# EAGLE design elflet (EAGLE 9.2.0)
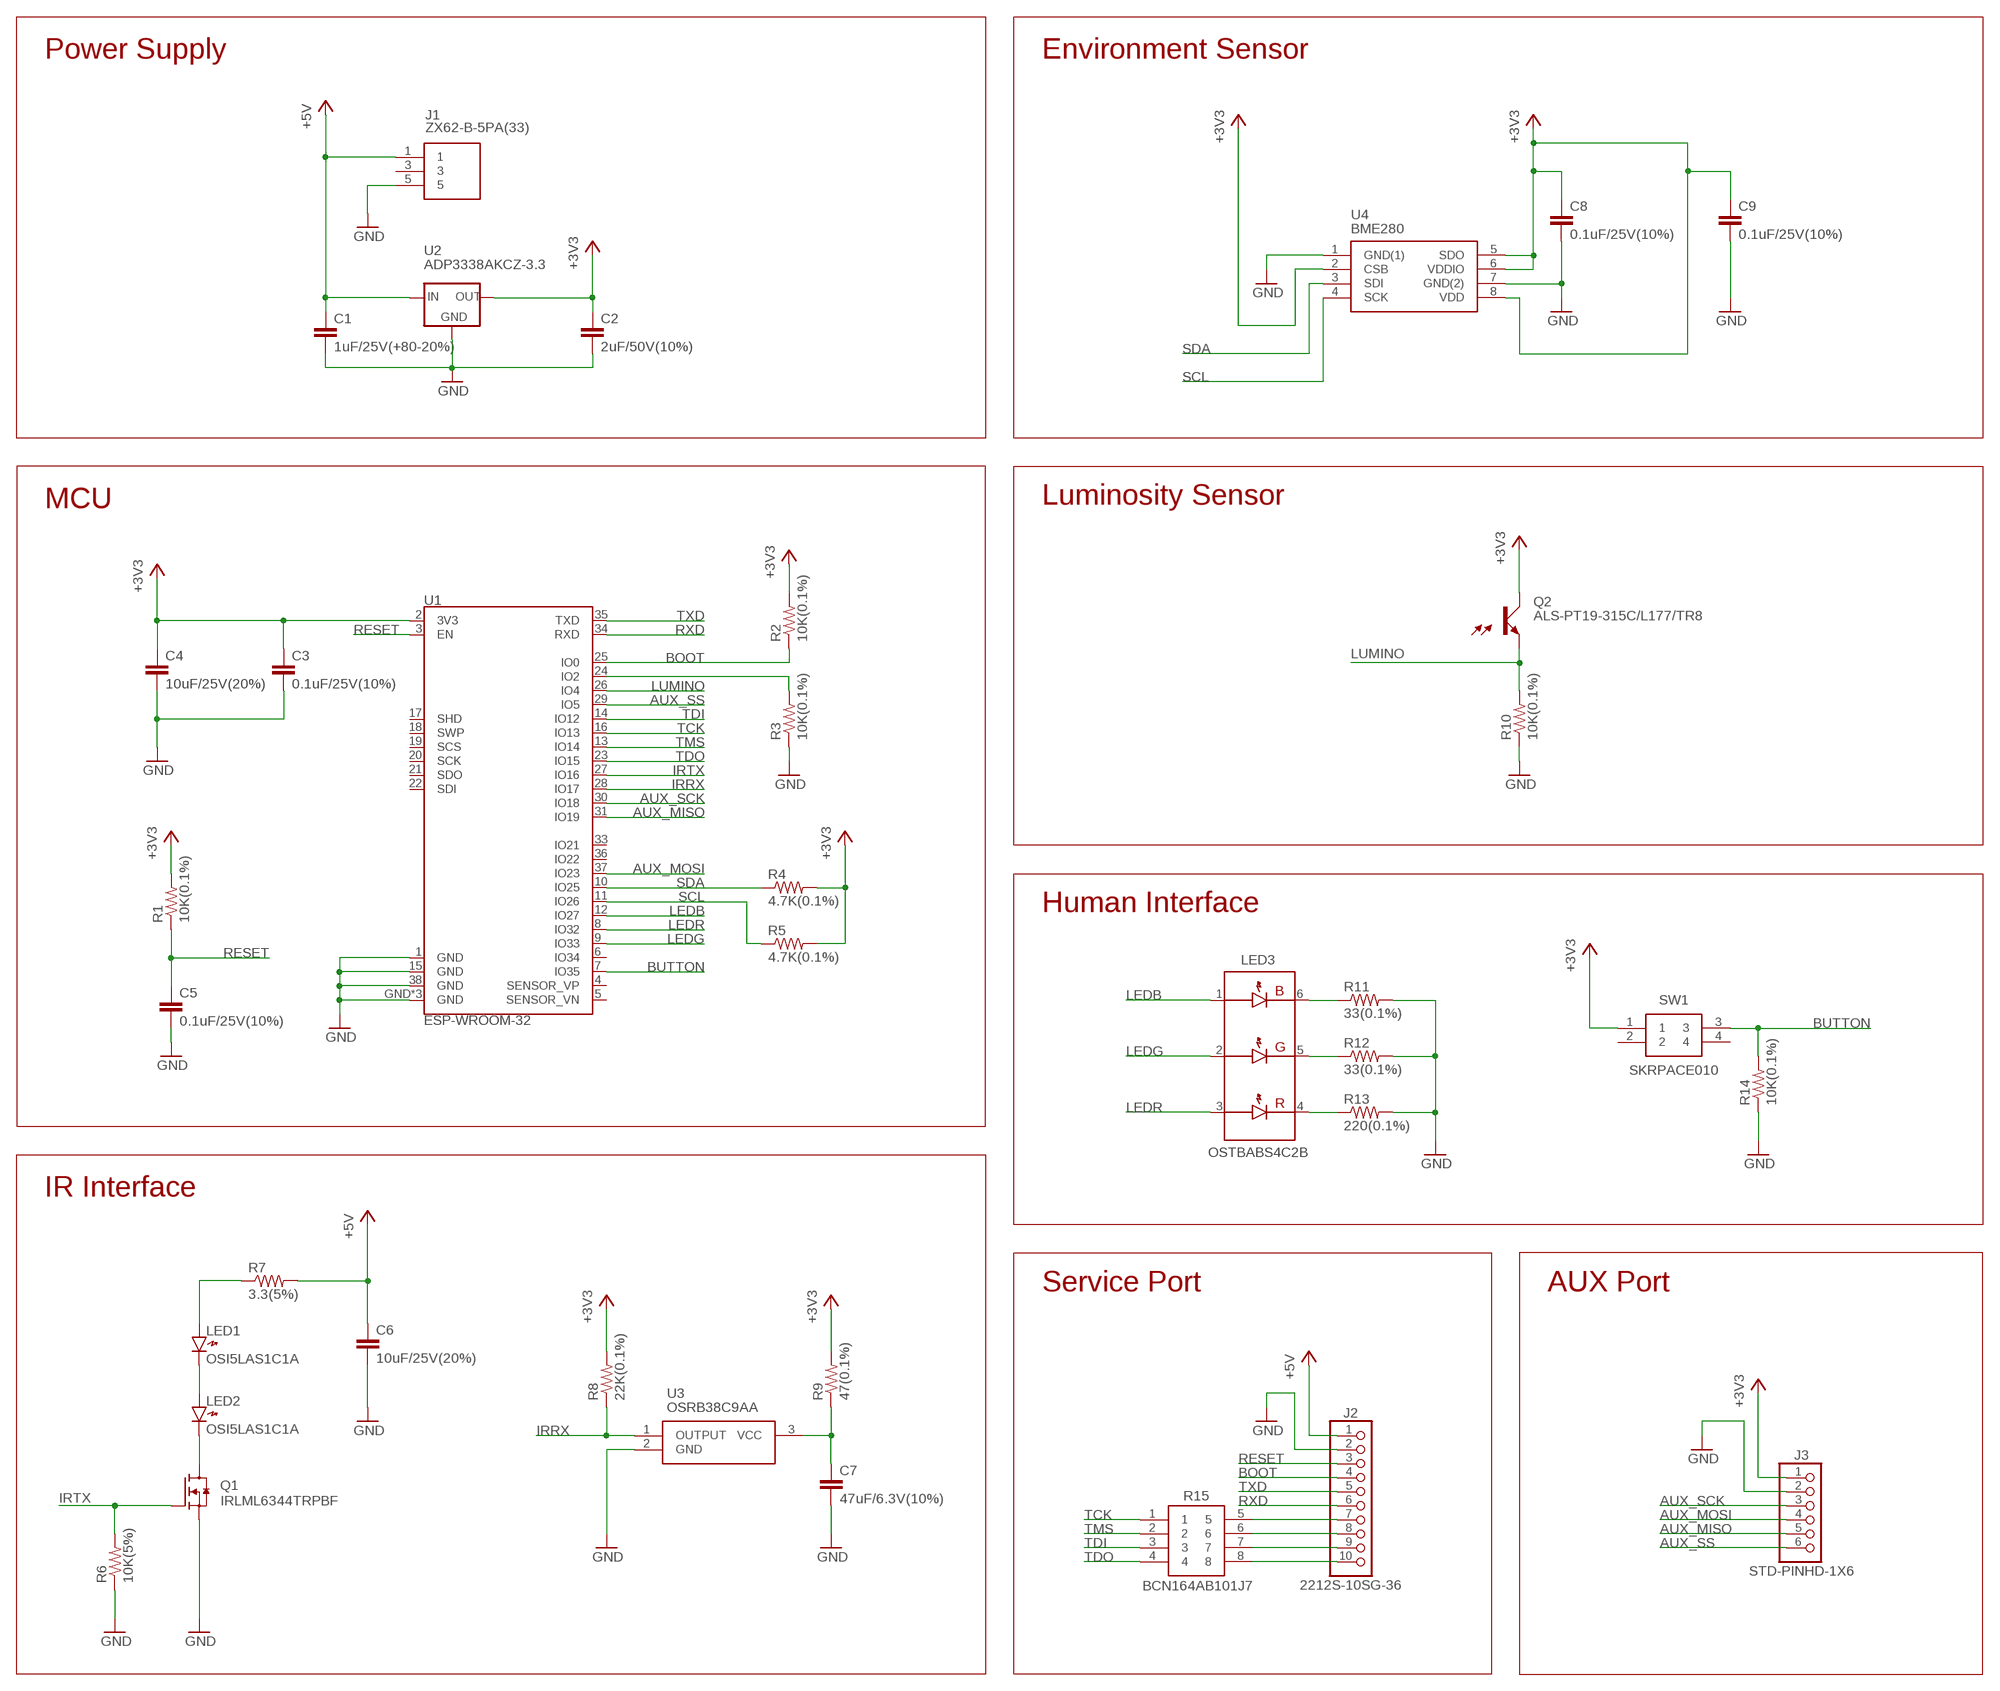
[diagram p0: schematic, sheet 1]

## Parts
C1  1uF/25V(+80-20%)  C-EUC3216  [C3216]
C2  2uF/50V(10%)  C-EUC3216  [C3216]
C3  0.1uF/25V(10%)  C-EUC1608  [C1608]
C4  10uF/25V(20%)  C-EUC1608  [C1608]
C5  0.1uF/25V(10%)  C-EUC1608  [C1608]
C6  10uF/25V(20%)  C-EUC1608  [C1608]
C7  47uF/6.3V(10%)  C-EUC3216  [C3216]
C8  0.1uF/25V(10%)  C-EUC1608  [C1608]
C9  0.1uF/25V(10%)  C-EUC1608  [C1608]
J1  ZX62-B-5PA(33)  [ZX62-B-5PA(33)-TRUE-HANDSOLD]
J2  2212S-10SG-36  STD-PINHD-1X10  [STD-1X10]
J3  STD-PINHD-1X6  [STD-1X6]
LED1  OSI5LAS1C1A  LEDPLCC-2  [PLCC-2]
LED2  OSI5LAS1C1A  LEDPLCC-2  [PLCC-2]
LED3  OSTBABS4C2B  [OSTBABS4C2B]
Q1  IRLML6344TRPBF  [SOT23]
Q2  ALS-PT19-315C/L177/TR8  ALS-PT19-315C_L177_TR8  [ALSPT19315CL177TR8]
R1  10K(0.1%)  R-US_R0805  [R0805]
R2  10K(0.1%)  R-US_R0805  [R0805]
R3  10K(0.1%)  R-US_R0805  [R0805]
R4  4.7K(0.1%)  R-US_R0603  [R0603]
R5  4.7K(0.1%)  R-US_R0603  [R0603]
R6  10K(5%)  R-US_R0805  [R0805]
R7  3.3(5%)  R-US_R2512  [R2512]
R8  22K(0.1%)  R-US_R0603  [R0603]
R9  47(0.1%)  R-US_R0603  [R0603]
R10  10K(0.1%)  R-US_R0805  [R0805]
R11  33(0.1%)  R-US_R0805  [R0805]
R12  33(0.1%)  R-US_R0805  [R0805]
R13  220(0.1%)  R-US_R0805  [R0805]
R14  10K(0.1%)  R-US_R0805  [R0805]
R15  BCN164AB101J7  BCN164A102J7  [BCN164A_1]
SW1  SKRPACE010  [SMT(4.2X3.2)]
U1  ESP-WROOM-32  ESP-WROOM-03  [ESP-WROOM-03]
U2  ADP3338AKCZ-3.3  ADP3338  [SOT223]
U3  OSRB38C9AA  OSRB38C9AATILT  [OSRB38C9AA-ALT]
U4  BME280  [BME280]

## Nets
+3V3 [power]: C2.1 C3.1 C4.1 C8.1 C9.1 J3.1 Q2.1(C) R1.2 R2.2 R4.2 R5.2 R8.2 R9.2 SW1.1 U1.2(3V3) U2.2(OUT) U2.4(OUT) U4.2(CSB) U4.5(SDO) U4.6(VDDIO) U4.8(VDD)
+5V [power]: C1.1 C6.1 J1.1 J2.1 R7.2 U2.3(IN)
AUX_MISO: J3.5 U1.31(IO19)
AUX_MOSI: J3.4 U1.37(IO23)
AUX_SCK: J3.3 U1.30(IO18)
AUX_SS: J3.6 U1.29(IO5)
BOOT: J2.4 R2.1 U1.25(IO0)
BUTTON: R14.2 SW1.3 U1.7(IO35)
GND [gnd]: C1.2 C2.2 C3.2 C4.2 C5.2 C6.2 C7.2 C8.2 C9.2 J1.5 J2.2 J3.2 Q1.2(S) R3.1 R6.1 R10.1 R11.2 R12.2 R13.2 R14.1 U1.1(GND) U1.15(GND) U1.38(GND) U1.GND U1.GND_B(GND) U1.GND_V(GND) U2.1(GND) U3.2(GND) U4.1(GND(1)) U4.7(GND(2))
IRRX: R8.1 U1.28(IO17) U3.1(OUTPUT)
IRTX: Q1.1(G) R6.2 U1.27(IO16)
LEDB: LED3.1(AB) U1.12(IO27)
LEDG: LED3.2(AG) U1.9(IO33)
LEDR: LED3.3(AR) U1.8(IO32)
LUMINO: Q2.2(E) R10.2 U1.26(IO4)
N$1: R3.2 U1.24(IO2)
N$2 [irled]: LED1.1(K) LED2.2(A)
N$3 [irled]: LED2.1(K) Q1.3(D)
N$4 [irled]: LED1.2(A) R7.1
N$5: C7.1 R9.1 U3.3(VCC)
N$6: J2.7 R15.5
N$7: J2.8 R15.6
N$8: J2.9 R15.7
N$9: LED3.6(KB) R11.1
N$10: LED3.5(KG) R12.1
N$11: LED3.4(KR) R13.1
N$12: J2.10 R15.8
RESET: C5.1 J2.3 R1.1 U1.3(EN)
RXD: J2.6 U1.34(RXD)
SCL: R5.1 U1.11(IO26) U4.4(SCK)
SDA: R4.1 U1.10(IO25) U4.3(SDI)
TCK: R15.1 U1.16(IO13)
TDI: R15.3 U1.14(IO12)
TDO: R15.4 U1.23(IO15)
TMS: R15.2 U1.13(IO14)
TXD: J2.5 U1.35(TXD)
Unconnected: J1.3 SW1.2 SW1.4 U1.4(SENSOR_VP) U1.5(SENSOR_VN) U1.6(IO34) U1.17(SHD) U1.18(SWP) U1.19(SCS) U1.20(SCK) U1.21(SDO) U1.22(SDI) U1.33(IO21) U1.36(IO22)

## Notes on the sheet
- Power Supply | Environment Sensor
- Luminosity Sensor
- MCU
- Human Interface
- IR Interface
- Service Port | AUX Port

## Library data of the parts
C1-C9 = rcl:C-EU: CAPACITOR, European symbol; SPICEPREFIX: C
J1 = ZX62-B-5PA(33):ZX62-B-5PA(33): USB Connectors MICRO B RECEPT RA SMT BTTM MNT Source: Datasheet <http://www.mouser.com/ds/2/185/ZX_catalog-939768.pdf>
J2 = connector:STD-PINHD-1X10
J3 = connector:STD-PINHD-1X6
LED1 LED2 = gen-discrete:LED: Generic LEDs
LED3 = OSTBABS4C2B:OSTBABS4C2B
Q1 = IRLML6344TRPBF:IRLML6344TRPBF: IRLML6433TRPBF
Q2 = ALS-PT19-315C_L177_TR8:ALS-PT19-315C_L177_TR8: Ambient Light Sensors Ambient Light Sensor Source: Datasheet <http://www.mouser.com/ds/2/143/201407061531031645-365293.pdf>; ARROW_PART_NUMBER: ALS-PT19-315C/L177/TR8; DESCRIPTION: Ambient Light Sensors Ambient Light Sensor; HEIGHT: 0mm; MANUFACTURER_NAME: Everlight; MANUFACTURER_PART_NUMBER: ALS-PT19-315C/L177/TR8
R1-R6 R8-R14 = rcl:R-US_: RESISTOR, American symbol; SPICEPREFIX: R
R7 = gen-discrete:R-US_: RESISTOR, American symbol; SPICEPREFIX: R
R15 = BCN164A102J7:BCN164A102J7: BI TECHNOLOGIES / TT ELECTRONICS - BCN164A102J7 - RESISTOR, RESISTOR ARRAY, 4, 1KOHM, 5%, 1206 Source: Datasheet <http://www.farnell.com/datasheets/2158867.pdf>; ARROW_PART_NUMBER: BCN164A102J7; DESCRIPTION: BI TECHNOLOGIES / TT ELECTRONICS - BCN164A102J7 - RESISTOR, RESISTOR ARRAY, 4, 1KOHM, 5%, 1206; HEIGHT: mm; MANUFACTURER_NAME: BI Technologies; MANUFACTURER_PART_NUMBER: BCN164A102J7
SW1 = SKRPACE010:SKRPACE010: Tactile Switches 4.2x3.2x2.5mm 260gf Source: Datasheet <http://www.alps.com/prod/info/E/HTML/Tact/SurfaceMount/SKRP/SKRPACE010.html>; ARROW_PART_NUMBER: SKRPACE010; DESCRIPTION: Tactile Switches 4.2x3.2x2.5mm 260gf; HEIGHT: mm; MANUFACTURER_NAME: ALPS; MANUFACTURER_PART_NUMBER: SKRPACE010
U1 = esp32:ESP-WROOM-03
U2 = vreg:ADP3338: ADP3338 low drop out regurator 1A
U3 = OSRB38C9AA:OSRB38C9AA: 7.4*6.2*5.25mm Infrared Receiver Module Source: Datasheet <http://akizukidenshi.com/download/OSRB38C9AA.pdf>
U4 = BME280:BME280: Board Mount Humidity Sensors Source: Datasheet <http://ae-bst.resource.bosch.com/media/products/dokumente/bme280/BST-BME280_DS001-11.pdf>

## Net classes
1 gnd: width 0.457 mm, drill 0.203 mm
2 power: width 0.457 mm, drill 0.203 mm
3 irled: width 0.457 mm, drill 0.203 mm

## Board
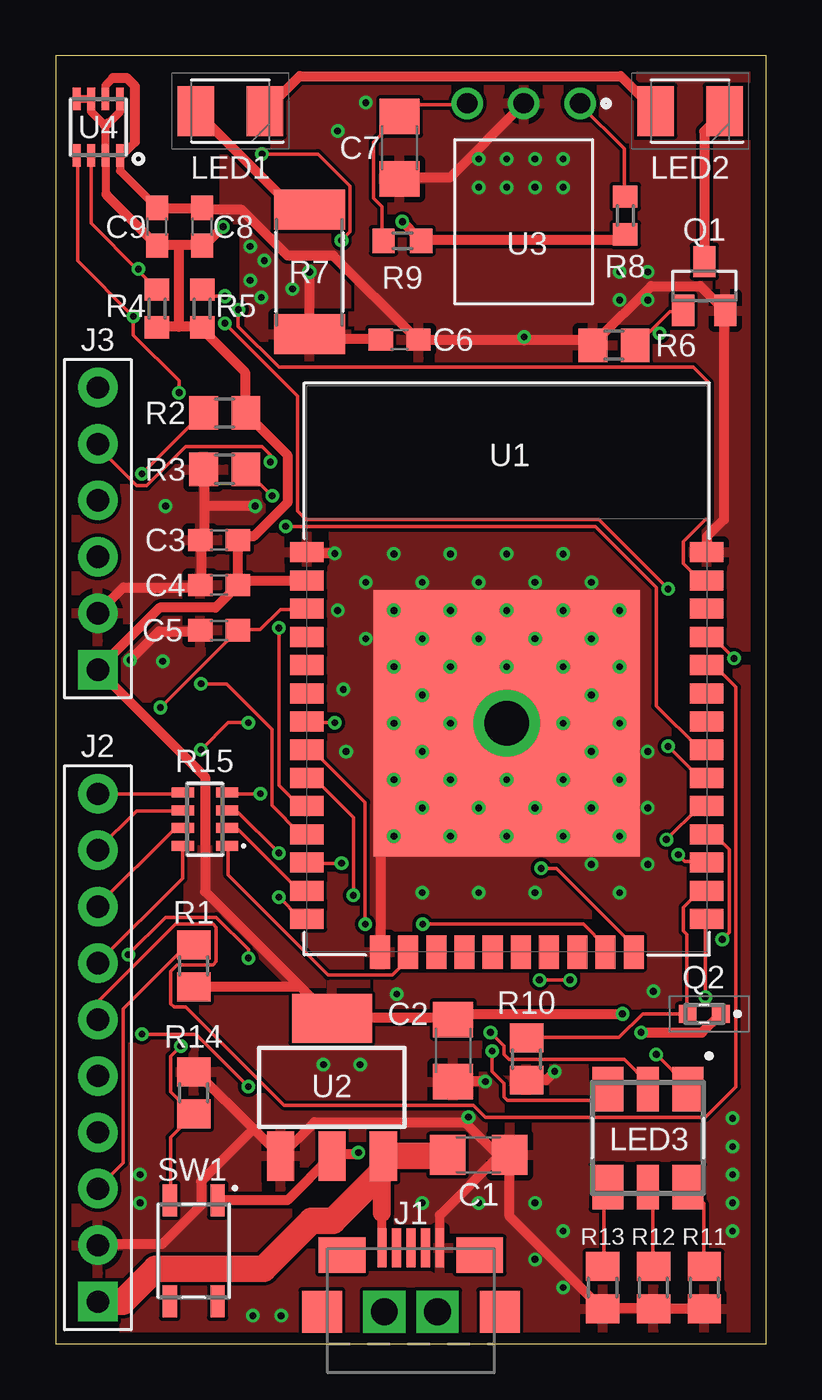
[diagram p1: board, top side]
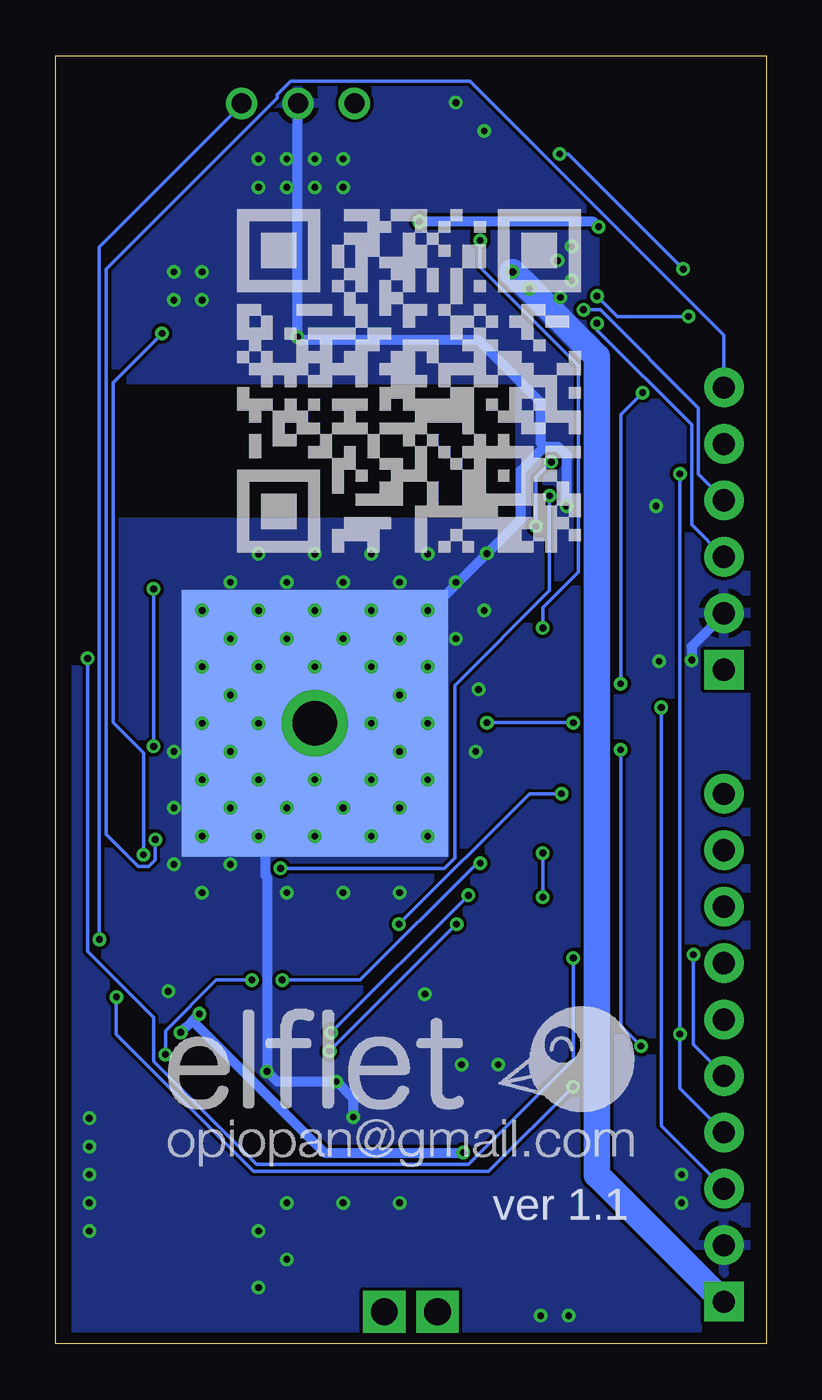
[diagram p2: board, bottom side, seen from below]

Size 32 x 58 mm. Coordinates in mm from the lower left corner, seen from the top.
Outline: 0,0 32,0 32,58 0,58 0,0
Copper layers (1*16): Top 0.035mm / dielectric 1.6mm / Bottom 0.035mm
Design rules "Elecrow_2-layer_PCB_eagle_rule": minimum track width 6mil, minimum drill 12mil, track to track 6mil, track to pad 6mil, pad to pad 6mil, via to via 8mil, smd to smd 0mil, copper to edge 20mil, drill to drill 10mil, minimum pad ring 6mil, minimum via ring 6mil, stop-mask expansion 0mil, vias tented up to drill 100mil, thermal gap 10mil
tRestrict: area 0,0 to 0.7,58; area 31.3,0 to 32,58; area 0,57.3 to 32,58
bRestrict: area 0,57.3 to 32,58; area 0,0 to 0.7,58; area 31.3,0 to 32,58

### Footprints (pad centres in the part's own frame; a part is rotated, then mirrored left to right if it is on the bottom)
C3216 = smd 1.6 x 1.8: 1 -1.4,0; 2 1.4,0
C1608 = smd 1.1 x 1: 1 -0.85,0; 2 0.85,0
ZX62-B-5PA(33)-TRUE-HANDSOLD = smd 0.4 x 1.75: 1 -1.3,2.875; 2 -0.65,2.875; 3 0,2.875; 4 0.65,2.875; 5 1.3,2.875 | smd 2.1 x 1.6: 6 -3.1,2.55; 7 3.1,2.55 | drill 1.2 pad 1.9 square: 8 -1.2,0; 9 1.2,0 | smd 1.8 x 1.9: 10 -4,0; 11 4,0
STD-1X10 = drill 1 pad 1.778 square: 1 -11.43,0 | drill 1 pad 1.778: 2 -8.89,0; 3 -6.35,0; 4 -3.81,0; 5 -1.27,0; 6 1.27,0; 7 3.81,0; 8 6.35,0; 9 8.89,0; 10 11.43,0
STD-1X6 = drill 1 pad 1.778 square: 1 -6.35,0 | drill 1 pad 1.778: 2 -3.81,0; 3 -1.27,0; 4 1.27,0; 5 3.81,0; 6 6.35,0
PLCC-2 = smd 1.65 x 2.25: 1 -1.55,0; 2 1.55,0
OSTBABS4C2B = smd 1.4 x 2: 1 1.8,2.2; 3 -1.8,2.2; 4 -1.8,-2.2; 6 1.8,-2.2 | smd 1 x 2: 2 0,2.2; 5 0,-2.2
SOT23 = smd 1 x 1.4: 1 -0.95,-1.1; 2 0.95,-1.1; 3 0,1.1
ALSPT19315CL177TR8 = smd 0.8 x 0.8: 1 -0.75,0; 2 0.75,0
R0805 = smd 1.3 x 1.5: 1 -0.95,0; 2 0.95,0
R0603 = smd 1 x 1.1: 1 -0.85,0; 2 0.85,0
R2512 = smd 1.8 x 3.2: 1 -2.8,0; 2 2.8,0
BCN164A_1 = smd 0.45 x 1: 1 -1.2,-1; 2 -0.4,-1; 3 0.4,-1; 4 1.2,-1; 5 -1.2,1; 6 -0.4,1; 7 0.4,1; 8 1.2,1
SMT(4.2X3.2) = smd 1.45 x 0.65: 1 -2.275,1.075; 2 2.275,1.075; 3 -2.275,-1.075; 4 2.275,-1.075
ESP-WROOM-03 = smd 0.9 x 1.5: 1 7.7,9; 2 6.43,9; 3 5.16,9; 4 3.89,9; 5 2.62,9; 6 1.35,9; 7 0.08,9; 8 -1.19,9; 9 -2.46,9; 10 -3.73,9; 11 -5,9; 12 -6.27,9; 13 -7.54,9; 14 -8.81,9; 25 -8.81,-9; 26 -7.54,-9; 27 -6.27,-9; 28 -5,-9; 29 -3.73,-9; 30 -2.46,-9; 31 -1.19,-9; 32 0.08,-9; 33 1.35,-9; 34 2.62,-9; 35 3.89,-9; 36 5.16,-9; 37 6.43,-9; 38 7.7,-9 | smd 1.5 x 0.9: 15 -10.3,5.715; 16 -10.3,4.445; 17 -10.3,3.175; 18 -10.3,1.905; 19 -10.3,0.635; 20 -10.3,-0.635; 21 -10.3,-1.905; 22 -10.3,-3.175; 23 -10.3,-4.445; 24 -10.3,-5.715 | smd 12 x 12: GND 0,0 | smd 12 x 12 bottom: GND_B 0,0 | drill 2: GND_V 0,0
SOT223 = smd 1.219 x 2.235: 1 -2.311,-3.099; 2 0,-3.099; 3 2.311,-3.099 | smd 3.6 x 2.2: 4 0,3.099
OSRB38C9AA-ALT = drill 0.91 pad 1.41: 1 -2.54,-1; 2 0,-1; 3 2.54,-1
BME280 = smd 1 x 0.35: 1 2.3,0; 2 2.3,-0.65; 3 2.3,-1.3; 4 2.3,-1.95; 5 -0.25,-1.95; 6 -0.25,-1.3; 7 -0.25,-0.65; 8 -0.25,0

### Placement (x,y rotation side)
C1  19.05,8.51 0 top
C2  17.91,13.21 270 top
C3  7.37,36.2 180 top
C4  7.37,34.16 180 top
C5  7.37,32.13 180 top
C6  15.49,45.21 0 top
C7  15.49,53.85 270 top
C8  6.6,50.29 90 top
C9  4.57,50.29 90 top
J1  16,1.45 0 top
J2  1.91,13.34 90 top
J3  1.91,36.7 90 top
LED1  7.87,55.5 180 top
LED2  28.57,55.5 180 top
LED3  26.67,9.27 0 top
Q1  29.21,47.62 0 top
Q2  29.21,14.86 180 top
R1  6.22,17.02 270 top
R2  7.62,41.91 0 top
R3  7.62,39.37 0 top
R4  4.57,46.61 270 top
R5  6.6,46.61 270 top
R6  25.15,44.96 0 top
R7  11.43,48.26 270 top
R8  25.65,50.8 270 top
R9  15.62,49.66 0 top
R10  21.21,12.83 90 top
R11  29.21,2.54 270 top
R12  26.92,2.54 270 top
R13  24.64,2.54 270 top
R14  6.22,11.3 270 top
R15  6.73,23.62 90 top
SW1  6.22,4.19 270 top
U1  20.32,27.94 90 top
U2  12.45,11.56 0 top
U3  21.08,54.85 180 top
U4  2.9,55.8 270 top
U$1  [ELFLET-LOGO]  26.92,7.75 0 bottom
U$2  [ELFLET-QRCODE]  25.91,33.53 0 bottom

### Tracks (layer width: path | path; a pad name or v marks a point on that pad's centre or on a via)
+3V3  (via drill 0.3)
  Top 0.35: U4.8 2.9,55.48 2.36,54.94 | U4.5 U4.6 1.6,55.47 2.21,54.86 2.25,54.82 U4.2 2.25,51.78 2.29,51.74
  Top 0.457: R1.2 11.03,16.07 U2.4 12.65,14.71 17.75,14.71 C2.1 17.91,14.63 18.14,14.86 v25.53,14.86 | U1.2 8.42,34.37 C4.1 7.2,33.15 4.7,33.15 J3.1 | SW1.1 7.32,6.48 10.44,6.48 12.42,8.46 U2.2 12.65,8.53 13.56,8.53 v13.64,8.61 | v26.36,14.02 29.11,14.02 29.95,14.86 Q2.1 | R8.2 25.6,49.91 25.38,49.68 16.54,49.68 R9.2 16.31,49.84 v15.62,50.52 | 2.36,54.94 2.21,54.86 | 5.56,49.45 6.55,49.45 C8.1 6.78,49.53 v7.54,50.29 | 5.56,49.45 4.57,49.45 C9.1 4.42,49.61 2.29,51.74 | 5.56,45.8 6.55,45.8 R5.2 6.71,45.57 8.53,43.74 8.53,41.91 R2.2 8.69,41.76 10.44,40.01 10.44,37.87 8.91,36.35 8.38,36.35 C3.1 | 5.56,45.8 4.57,45.8 R4.2 | 5.56,45.8 5.56,49.45
  Top 0.46: J3.1 6.73,25.53 6.73,20.37 U2.4 | C4.1 C3.1
  Bottom 0.457: v25.53,14.86 25.83,14.55 | 25.83,14.55 v26.36,14.02 | v13.64,8.61 19.89,8.61 25.83,14.55 | v15.62,50.52 7.77,50.52 v7.54,50.29
  pour Top: 13.97,15.24 13.97,16.51 12.06,16.51 7.49,21.08 7.49,22.23 5.97,22.23 5.97,19.43 7.37,19.43 10.79,16 10.79,15.24
+5V  (via drill 0.3, 0.35)
  Top 0.4: J1.1 14.7,5.9
  Top 0.457: C6.1 14.63,45.26 11.81,45.26 11.66,45.41 R7.2
  Top 0.46: R7.2 v11.43,48.26
  Top 0.8: 14.7,5.9 14.7,7.75 14.7,8.4 U2.3 | 17.6,8.46 C1.1
  Top 1.2: 14.7,7.75 12.51,5.55 11.54,5.55 9.38,3.39 4.51,3.39 3.02,1.91 J2.1 | U2.3 17.6,8.46
  Bottom 1.2: J2.1 7.62,7.62 7.62,44.45 v10.67,47.5 v11.43,48.26
  other vias: 8.76,49.4 9.4,48.77 8.76,47.88 9.27,47.12
  pour Top: 13.08,44.45 9.91,44.45 8.51,45.85 8.51,50.42 10.16,48.77 12.45,48.77 13.08,48.13
  pour Bottom: 8.38,44.32 12.57,48.51 12.57,50.04 7.75,50.04 7.75,44.83 8.38,44.2
AUX_MISO  (via drill 0.3)
  Top 0.152: v10.36,36.8 24.31,36.8 27.05,34.06 27.05,28.73 28.96,26.82 29.26,26.82 U1.31 | v9.68,39.7 9.68,40.01 9.3,40.39 5.87,40.39 4.12,38.63 3.66,38.63 1.91,40.39 J3.5
  Bottom 0.152: v10.36,36.8 10.36,39.01 v9.68,39.7
AUX_MOSI  (via drill 0.3)
  Top 0.152: v8.23,46.56 8.23,45.8 10.06,43.97 28.73,43.97 29.41,43.28 29.41,37.11 29.26,37.11 28.27,36.12 28.27,35.13 28.96,34.44 29.26,34.44 U1.37
  Bottom 0.152: v8.23,46.56 7.47,46.56 3.05,42.14 3.05,39.17 1.91,38.02 J3.4
AUX_SCK  (via drill 0.3)
  Top 0.152: v27.58,26.9 28.96,25.53 29.26,25.53 U1.30 | v27.58,33.98 24.46,37.11 11.28,37.11 10.9,37.49 10.9,42.67 v7.62,45.95
  Bottom 0.152: v27.58,33.98 v27.58,26.9 | v7.62,45.95 7.62,45.64 3.35,41.38 3.35,36.88 J3.3
AUX_SS  (via drill 0.3)
  Top 0.152: v27.51,22.71 28.96,24.16 29.26,24.16 U1.29
  Bottom 0.152: v27.51,22.71 27.51,21.79 27.81,21.49 28.27,21.49 29.72,22.94 29.72,48.39 22.02,56.08 22.02,56.24 21.41,56.84 13.34,56.84 1.91,45.41 J3.6
BOOT  (via drill 0.3)
  Top 0.152: v3.89,39.17 6.63,41.91 R2.1 | v29.26,15.62 29.26,19.13 U1.25 | v8.69,11.58 6.33,13.95 v3.89,13.95
  Bottom 0.152: v3.89,39.17 v3.89,13.95 3.89,11.51 J2.4 | v29.26,15.62 29.26,13.95 23.09,7.77 12.5,7.77 v8.69,11.58
BUTTON  (via drill 0.3)
  Top 0.152: SW1.3 5.18,6.48 5.18,9.3 6.17,10.29 R14.2 6.17,10.36 5.18,11.35 5.18,12.95 v5.64,13.41 | v12.57,27.96 11.35,27.96 U1.7 | v8.69,27.96 7.77,27.96 v6.55,26.75
  Bottom 0.152: v8.69,27.96 v12.57,27.96 | v6.55,26.75 6.55,14.33 v5.64,13.41
GND  (via drill 0.3)
  Top 0.35: U4.7 2.25,56.66 2.59,57 | 3.58,54.1 2.98,53.5 U4.1 2.9,52.81 C9.2
  Top 0.4: J1.5 17.3,5.8
  Top 0.457: C7.2 15.54,52.5 17.75,52.5 21.03,55.78 U3.2 | 4.57,51.21 C9.2 4.72,51.13 6.55,51.13 C8.2 6.78,51.05 8.38,51.05 10.44,49 12.5,49 16.15,45.34 C6.2 16.38,45.19 21.11,45.19 | 2.59,57 3.2,57 3.58,56.62 3.58,54.1 | 21.11,45.19 23.93,45.19 24.16,44.96 R6.1 24.31,45.11 26.82,47.62 29.03,47.62 30.1,46.56 Q1.2 30.1,46.33 30.1,37.11 29.34,36.35 29.34,35.66 U1.38 | v21.11,45.34 21.11,45.19 | R13.2 24.69,1.6 26.9,1.6 R12.2 27.13,1.6 29.18,1.6 R11.2 | 20.42,7.77 20.42,8.46 C1.2 | 24.46,1.68 R13.2 | 8.91,9.68 U2.1 11.66,9.98 18.44,9.98 | 8.91,9.68 6.4,12.19 6.25,12.19 R14.1 | 8.91,9.68 6.55,7.32 6.55,6.25 4.8,4.5 1.91,4.5 J2.2 | 18.44,9.98 19.96,8.46 20.19,8.46 C1.2 | U1.15 14.63,17.68 14.63,22.25 U1.GND_V 20.34,27.96 | 6.71,37.72 6.71,36.35 C3.2 6.55,36.2 6.55,34.21 C4.2 6.33,34.06 3.05,34.06 1.91,32.92 J3.2 | 6.71,37.72 6.71,39.32 R3.1 | v3.35,30.79 4.65,32.08 6.48,32.08 C5.2 | v22.48,12.27 22.1,11.89 21.26,11.89 R10.1 | v12.57,35.59 11.35,35.59 U1.1 | v19.36,11.81 C2.2 | v8.99,37.72 6.71,37.72 | v18.59,10.21 18.59,10.13 18.44,9.98 | C1.2 20.01,8.51 17.3,5.8 | R13.2 24.6,1.59 20.45,5.74 C1.2
  Bottom 0.457: U3.2 21.11,55.78 v21.11,45.34 20.95,45.19 12.95,45.19 10.13,42.37 10.13,40.54 9.98,40.39 | v3.35,30.79 3.35,31.39 1.91,32.84 J3.2 | U1.GND_V 20.34,27.89 22.55,25.68 22.55,21.11 22.48,21.03 v22.48,12.27 22.02,11.81 v19.36,11.81 18.59,11.05 v18.59,10.21 | U1.GND_V 20.12,28.04 v12.57,35.59 11.05,37.11 11.05,39.32 9.98,40.39 | v8.99,37.72 8.99,40.01 9.37,40.39 9.98,40.39 | 20.34,27.96 U1.GND_V
  other vias: 15.24,35.56 17.78,35.56 20.32,35.56 22.86,35.56 13.97,34.29 16.51,34.29 19.05,34.29 21.59,34.29 24.13,34.29 12.7,33.02 15.24,33.02 17.78,33.02 20.32,33.02 22.86,33.02 25.4,33.02 13.97,31.75 16.51,31.75 19.05,31.75 21.59,31.75 24.13,31.75 15.24,30.48 17.78,30.48 20.32,30.48 22.86,30.48 25.4,30.48 16.51,29.21 24.13,29.21 15.24,27.94 17.78,27.94 22.86,27.94 25.4,27.94 16.51,26.67 24.13,26.67 26.67,26.67 15.24,25.4 17.78,25.4 20.32,25.4 22.86,25.4 25.4,25.4 26.67,24.13 24.13,24.13 21.59,24.13 19.05,24.13 16.51,24.13 15.24,22.86 17.78,22.86 20.32,22.86 22.86,22.86 25.4,22.86 26.67,21.59 24.13,21.59 25.4,20.32 16.51,20.32 19.05,20.32 21.59,20.32 12.95,29.46 13.08,26.67 16.51,6.35 19.05,6.35 21.59,6.35 22.86,5.08 21.59,3.81 22.86,2.54 30.48,10.16 30.48,8.89 30.48,7.62 30.48,6.35 30.48,5.08 10.16,1.27 8.89,1.27 3.81,6.35 3.81,7.62 4.95,37.72 4.83,30.73 19.05,53.34 20.32,53.34 21.59,53.34 22.86,53.34 19.05,52.07 20.32,52.07 21.59,52.07 22.86,52.07 25.4,48.26 26.67,48.26 26.67,46.99 25.4,46.99 12.7,54.61 13.97,55.88 15.37,15.75 13.72,12.57 12.06,12.57 26.92,15.88
  pour Bottom (rank 6): -1.27,44.45 7.62,44.45 7.62,58.42 33.02,58.42 33.02,1.27 33.02,-1.27 1.27,-1.27 -1.27,-1.27
  pour Top (rank 6): -2.54,44.45 7.62,44.45 7.62,59.69 34.29,59.69 34.29,-2.54 1.27,-2.54 -2.54,-2.54
IRRX  (via drill 0.3)
  Top 0.152: R8.1 25.6,51.66 25.6,53.8 23.62,55.78 U3.1 | v30.02,18.21 30.33,18.52 30.33,22.25 29.64,22.94 29.34,22.94 U1.28
  Bottom 0.152: v30.02,18.21 30.02,49.38 23.62,55.78 U3.1
IRTX  (via drill 0.3)
  Top 0.152: 26.94,45.76 26.14,44.96 R6.2 | 26.94,45.76 27.66,46.48 28.19,46.48 Q1.1 | v28.04,22.02 28.35,21.72 29.26,21.72 U1.27 | 26.94,45.76 v27.2,45.49
  Bottom 0.152: v28.04,22.02 28.04,26.59 29.41,27.96 29.41,43.28 v27.2,45.49
LEDB  (via drill 0.3)
  Top 0.152: 28.5,11.51 LED3.1 28.5,11.58 v27.05,13.03 | v12.88,21.64 11.35,21.64 U1.12 | v23.16,16.38 v21.79,16.38
  Bottom 0.152: v12.88,21.64 13.03,21.64 18.29,16.38 v21.79,16.38 | v23.16,16.38 24.77,16.38 27.05,14.1 v27.05,13.03
LEDG  (via drill 0.3)
  Top 0.152: v13.41,20.19 13.41,23.7 11.66,25.45 11.35,25.45 U1.9 | v19.58,14.02 20.19,13.41 20.19,13.03 20.42,12.8 25.6,12.8 26.67,11.73 LED3.2
  Bottom 0.152: v19.58,14.02 v13.41,20.19
LEDR  (via drill 0.3)
  Top 0.152: v13.95,18.9 13.95,24.38 11.58,26.75 11.35,26.75 U1.8 | v19.66,13.18 19.66,12.27 20.19,11.73 20.19,11.12 20.34,10.97 24.38,10.97 24.84,11.43 LED3.3
  Bottom 0.152: v19.66,13.18 v13.95,18.9
LUMINO
  Top 0.152: 28.42,14.86 28.42,18.44 28.27,18.59 28.27,19.66 28.96,20.34 29.26,20.34 U1.26 | 28.42,14.86 26.44,14.86 25.38,13.79 21.26,13.79 R10.2 | 28.42,14.86 Q2.2
N$1  (via drill 0.3)
  Top 0.152: v9.75,38.18 8.61,39.32 R3.2 | v21.87,21.41 22.55,21.41 25.98,17.98 25.98,17.68 U1.24
  Bottom 0.152: v9.75,38.18 9.75,33.91 14.02,29.64 14.02,21.87 14.48,21.41 v21.87,21.41
N$2
  Top 0.46: LED1.1 10.99,57.07 25.45,57.07 LED2.2
N$3
  Top 0.457: LED2.1 29.21,54.58 Q1.3
N$4
  Top 0.457: R7.1 10.76,51.06 LED1.2
N$5
  Top 0.152: R9.1 14.71,49.68 14.71,51.21 14.33,51.59 14.33,54.1 15.47,55.24 C7.1 15.54,55.32 16,55.78 18.52,55.78 U3.3
N$6
  Top 0.152: J2.7 5.71,20.95 5.71,22.4 R15.5
N$7
  Top 0.152: R15.6 5.71,23.16 5.33,23.16 1.91,19.74 J2.8
N$8
  Top 0.152: R15.7 5.71,24 3.66,24 1.91,22.25 J2.9
N$9
  Top 0.152: R11.1 29.18,3.5 29.18,6.33 28.5,7.01 LED3.6
N$10
  Top 0.152: R12.1 26.9,3.5 26.9,6.78 26.67,7.01 LED3.5
N$11
  Top 0.152: R13.1 24.69,3.5 24.69,6.86 24.84,7.01 LED3.4
N$12
  Top 0.152: J2.10 5.71,24.77 R15.8
RESET  (via drill 0.3)
  Top 0.152: U1.3 11.28,33.07 10.13,33.07 9.22,32.16 8.23,32.16 C5.1 8.15,32.08 v4.72,28.65 | R1.1 6.17,17.91 5.87,17.91 3.05,15.09 3.05,8.15 1.91,7.01 J2.3
  Bottom 0.152: v4.72,28.65 4.72,9.83 1.91,7.01 J2.3
RXD
  Top 0.152: J2.6 1.91,15.39 5.41,18.9 7.09,18.9 7.24,18.75 7.24,17.22 7.09,17.07 5.49,17.07 5.18,16.76 5.18,15.32 5.33,15.16 5.87,15.16 10.29,10.74 18.82,10.74 19.36,10.21 29.26,10.21 30.63,11.58 30.63,29.57 29.64,30.56 29.34,30.56 U1.34
SCL  (via drill 0.3)
  Top 0.152: v7.62,47.17 6.86,47.17 6.63,47.4 R5.1 | U4.4 0.99,53.49 0.99,48.77 v3.5,46.25 3.5,45.41 5.56,43.36 v5.56,42.82 | v6.55,29.72 7.7,29.72 9.75,27.66 9.75,24.23 10.97,23.01 11.28,23.01 U1.11
  Bottom 0.152: v3.5,46.25 6.71,46.25 v7.62,47.17 | v6.55,29.72 6.55,41.83 v5.56,42.82
SDA  (via drill 0.3)
  Top 0.152: 3.7,48.35 4.57,47.47 R4.1 | 3.7,48.35 1.6,50.44 U4.3 | v10.06,32.23 10.06,25.15 10.97,24.23 11.28,24.23 U1.10 | v12.88,49.68 13.26,50.06 13.26,52.12 11.81,53.57 v9.3,53.57 | v3.73,48.39 3.7,48.35
  Bottom 0.152: v10.06,32.23 10.06,33.15 8.46,34.75 8.46,44.04 12.88,48.46 v12.88,49.68 | v9.3,53.57 8.91,53.57 v3.73,48.39
TCK
  Top 0.152: R15.1 7.77,22.4 7.77,21.11 12.27,16.61 15.16,16.61 15.85,17.3 15.85,17.6 U1.16
TDI  (via drill 0.3)
  Top 0.152: v10.06,22.1 8.15,24 7.77,24 R15.3 | v10.06,20.12 10.97,19.2 11.28,19.2 U1.14
  Bottom 0.152: v10.06,20.12 v10.06,22.1
TDO  (via drill 0.3)
  Top 0.152: v9.22,24.77 7.77,24.77 R15.4 | v16.54,18.9 23.77,18.9 24.77,17.91 U1.23
  Bottom 0.152: v9.22,24.77 10.67,24.77 v16.54,18.9
TMS
  Top 0.152: R15.2 7.77,23.16 8.23,23.16 10.97,20.42 11.28,20.42 U1.13
TXD  (via drill 0.3)
  Top 0.152: v30.56,30.86 29.64,31.77 29.34,31.77 U1.35 | v8.69,17.37 8.69,17.75 7.24,19.2 4.95,19.2 v3.28,17.53
  Bottom 0.152: v30.56,30.86 30.56,17.68 27.58,14.71 27.58,12.72 22.94,8.08 13.41,8.08 8.69,12.8 v8.69,17.37 | v3.28,17.53 3.28,13.49 1.91,12.12 J2.5

### Text on the board
bPlace: ver 1.1